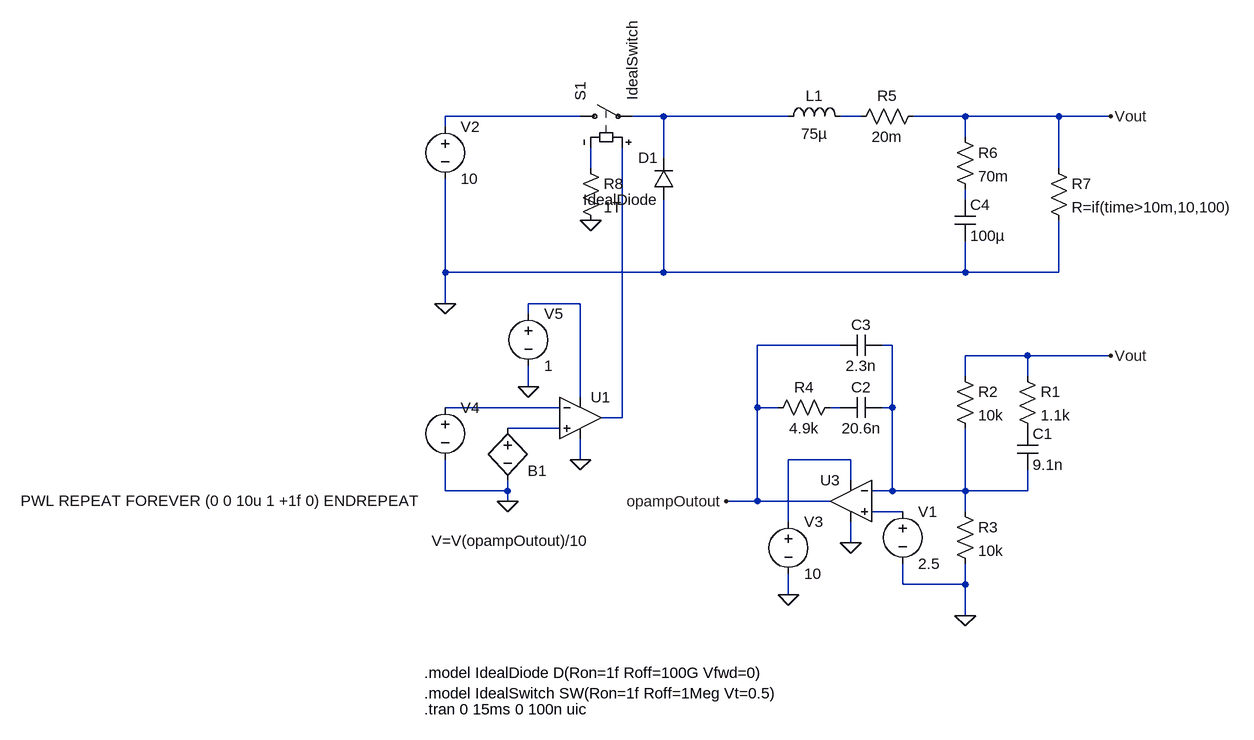
[diagram p0: schematic test_DCM_VM_switching.asc]
test_DCM_VM_switching.asc, the LTspice schematic file:
Version 4
SHEET 1 1144 896
WIRE -176 -32 -384 -32
WIRE -48 -32 -96 -32
WIRE 144 -32 -48 -32
WIRE 256 -32 224 -32
WIRE 416 -32 336 -32
WIRE 560 -32 416 -32
WIRE 640 -32 560 -32
WIRE -384 -16 -384 -32
WIRE 416 0 416 -32
WIRE -48 32 -48 -32
WIRE -160 48 -160 16
WIRE 560 48 560 -32
WIRE 416 96 416 80
WIRE -384 208 -384 64
WIRE -48 208 -48 96
WIRE -48 208 -384 208
WIRE 416 208 416 160
WIRE 416 208 -48 208
WIRE 560 208 560 128
WIRE 560 208 416 208
WIRE -384 256 -384 208
WIRE -176 256 -256 256
WIRE -256 272 -256 256
WIRE 224 320 96 320
WIRE 304 320 288 320
WIRE 512 336 416 336
WIRE 640 336 512 336
WIRE 416 368 416 336
WIRE 512 368 512 336
WIRE -256 384 -256 352
WIRE -176 400 -176 256
WIRE -208 416 -384 416
WIRE 96 416 96 320
WIRE 128 416 96 416
WIRE 224 416 208 416
WIRE 304 416 304 320
WIRE 304 416 288 416
WIRE -112 432 -112 16
WIRE -112 432 -144 432
WIRE -208 448 -288 448
WIRE -176 496 -176 464
WIRE 240 496 144 496
WIRE 240 528 240 496
WIRE -384 544 -384 496
WIRE -288 544 -288 528
WIRE -288 544 -384 544
WIRE 304 544 304 416
WIRE 304 544 272 544
WIRE 416 544 416 448
WIRE 416 544 304 544
WIRE 512 544 512 512
WIRE 512 544 416 544
WIRE -288 560 -288 544
WIRE 96 560 96 416
WIRE 96 560 48 560
WIRE 208 560 96 560
WIRE 320 576 272 576
WIRE 416 576 416 544
WIRE 144 592 144 496
WIRE 240 624 240 592
WIRE 320 688 320 656
WIRE 416 688 416 656
WIRE 416 688 320 688
WIRE 144 704 144 672
WIRE 416 736 416 688
FLAG 416 736 0
FLAG -384 256 0
FLAG 240 624 0
FLAG 144 704 0
FLAG 640 336 Vout
FLAG 640 -32 Vout
FLAG 48 560 opampOutout
FLAG -288 560 0
FLAG -176 496 0
FLAG -256 384 0
FLAG -160 128 0
SYMBOL res 496 352 R0
SYMATTR InstName R1
SYMATTR Value 1.1k
SYMBOL cap 496 448 R0
SYMATTR InstName C1
SYMATTR Value 9.1n
SYMBOL res 400 352 R0
SYMATTR InstName R2
SYMATTR Value 10k
SYMBOL res 400 560 R0
SYMATTR InstName R3
SYMATTR Value 10k
SYMBOL voltage 320 560 R0
WINDOW 123 0 0 Left 0
WINDOW 39 0 0 Left 0
SYMATTR InstName V1
SYMATTR Value 2.5
SYMBOL cap 288 400 R90
WINDOW 0 0 32 VBottom 2
WINDOW 3 32 32 VTop 2
SYMATTR InstName C2
SYMATTR Value 20.6n
SYMBOL cap 288 304 R90
WINDOW 0 0 32 VBottom 2
WINDOW 3 32 32 VTop 2
SYMATTR InstName C3
SYMATTR Value 2.3n
SYMBOL res 224 400 R90
WINDOW 0 0 56 VBottom 2
WINDOW 3 32 56 VTop 2
SYMATTR InstName R4
SYMATTR Value 4.9k
SYMBOL voltage -384 -32 R0
WINDOW 123 0 0 Left 0
WINDOW 39 0 0 Left 0
SYMATTR InstName V2
SYMATTR Value 10
SYMBOL ind 128 -16 R270
WINDOW 0 32 56 VTop 2
WINDOW 3 5 56 VBottom 2
SYMATTR InstName L1
SYMATTR Value 75µ
SYMBOL res 352 -48 R90
WINDOW 0 0 56 VBottom 2
WINDOW 3 32 56 VTop 2
SYMATTR InstName R5
SYMATTR Value 20m
SYMBOL res 400 -16 R0
SYMATTR InstName R6
SYMATTR Value 70m
SYMBOL cap 400 96 R0
SYMATTR InstName C4
SYMATTR Value 100µ
SYMBOL voltage 144 576 R0
WINDOW 123 0 0 Left 0
WINDOW 39 0 0 Left 0
SYMATTR InstName V3
SYMATTR Value 10
SYMBOL res 544 32 R0
SYMATTR InstName R7
SYMATTR Value R=if(time>10m,10,100)
SYMBOL bv -288 432 R0
WINDOW 0 31 81 Left 2
WINDOW 3 -117 189 Left 2
SYMATTR InstName B1
SYMATTR Value V=V(opampOutout)/10
SYMBOL sw -192 -32 R270
SYMATTR InstName S1
SYMATTR Value IdealSwitch
SYMBOL voltage -384 400 R0
WINDOW 3 -653 159 Left 2
SYMATTR InstName V4
SYMATTR Value PWL REPEAT FOREVER (0 0 10u 1 +1f 0) ENDREPEAT
SYMBOL diode -32 96 R180
WINDOW 0 24 64 Left 2
WINDOW 3 24 0 Left 2
SYMATTR InstName D1
SYMATTR Value IdealDiode
SYMBOL voltage -256 256 R0
WINDOW 123 0 0 Left 0
WINDOW 39 0 0 Left 0
SYMATTR InstName V5
SYMATTR Value 1
SYMBOL res -176 32 R0
SYMATTR InstName R8
SYMATTR Value 1T
SYMBOL OpAmps\\UniversalOpAmp2 240 560 M0
SYMATTR InstName U3
SYMBOL OpAmps\\UniversalOpAmp2 -176 432 R0
SYMATTR InstName U1
TEXT -416 880 Left 2 !.tran 0 15ms 0 100n uic
TEXT -416 824 Left 2 !.model IdealDiode D(Ron=1f Roff=100G Vfwd=0)\n.model IdealSwitch SW(Ron=1f Roff=1Meg Vt=0.5)

The netlist it stands for:
* test_DCM_VM_switching.asc
R1 Vout P001 1.1k
C1 P001 N007 9.1n
R2 Vout N007 10k
R3 N007 0 10k
V1 N013 0 2.5
C2 N007 N009 20.6n
C3 N007 opampOutout 2.3n
R4 N009 opampOutout 4.9k
V2 N001 0 10
L1 N002 N003 75µ
R5 Vout N003 20m
R6 Vout N005 70m
C4 N005 0 100µ
V3 N012 0 10
R7 Vout 0 R=if(time>10m,10,100)
B1 N011 0 V=V(opampOutout)/10
S1 N001 N002 N010 N004 IdealSwitch
V4 N008 0 PWL REPEAT FOREVER (0 0 10u 1 +1f 0) ENDREPEAT
D1 0 N002 IdealDiode
V5 N006 0 1
R8 N004 0 1T
XU3 N013 N007 N012 0 opampOutout level2 Avol=1Meg GBW=10Meg Slew=10Meg Ilimit=25m Rail=0 Vos=0 En=0 Enk=0 In=0 Ink=0 Rin=500Meg  ; pins In+ In- V+ V- OUT
XU1 N011 N008 N006 0 N010 level2 Avol=1Meg GBW=10Meg Slew=10Meg Ilimit=25m Rail=0 Vos=0 En=0 Enk=0 In=0 Ink=0 Rin=500Meg  ; pins In+ In- V+ V- OUT
.model D D
.lib standard.dio
.tran 0 15ms 0 100n uic
.model IdealDiode D(Ron=1f Roff=100G Vfwd=0)
.model IdealSwitch SW(Ron=1f Roff=1Meg Vt=0.5)
.lib UniversalOpAmp2.lib
.backanno
.end